# EAGLE schematic RC Receiver (EAGLE 6.5.0)
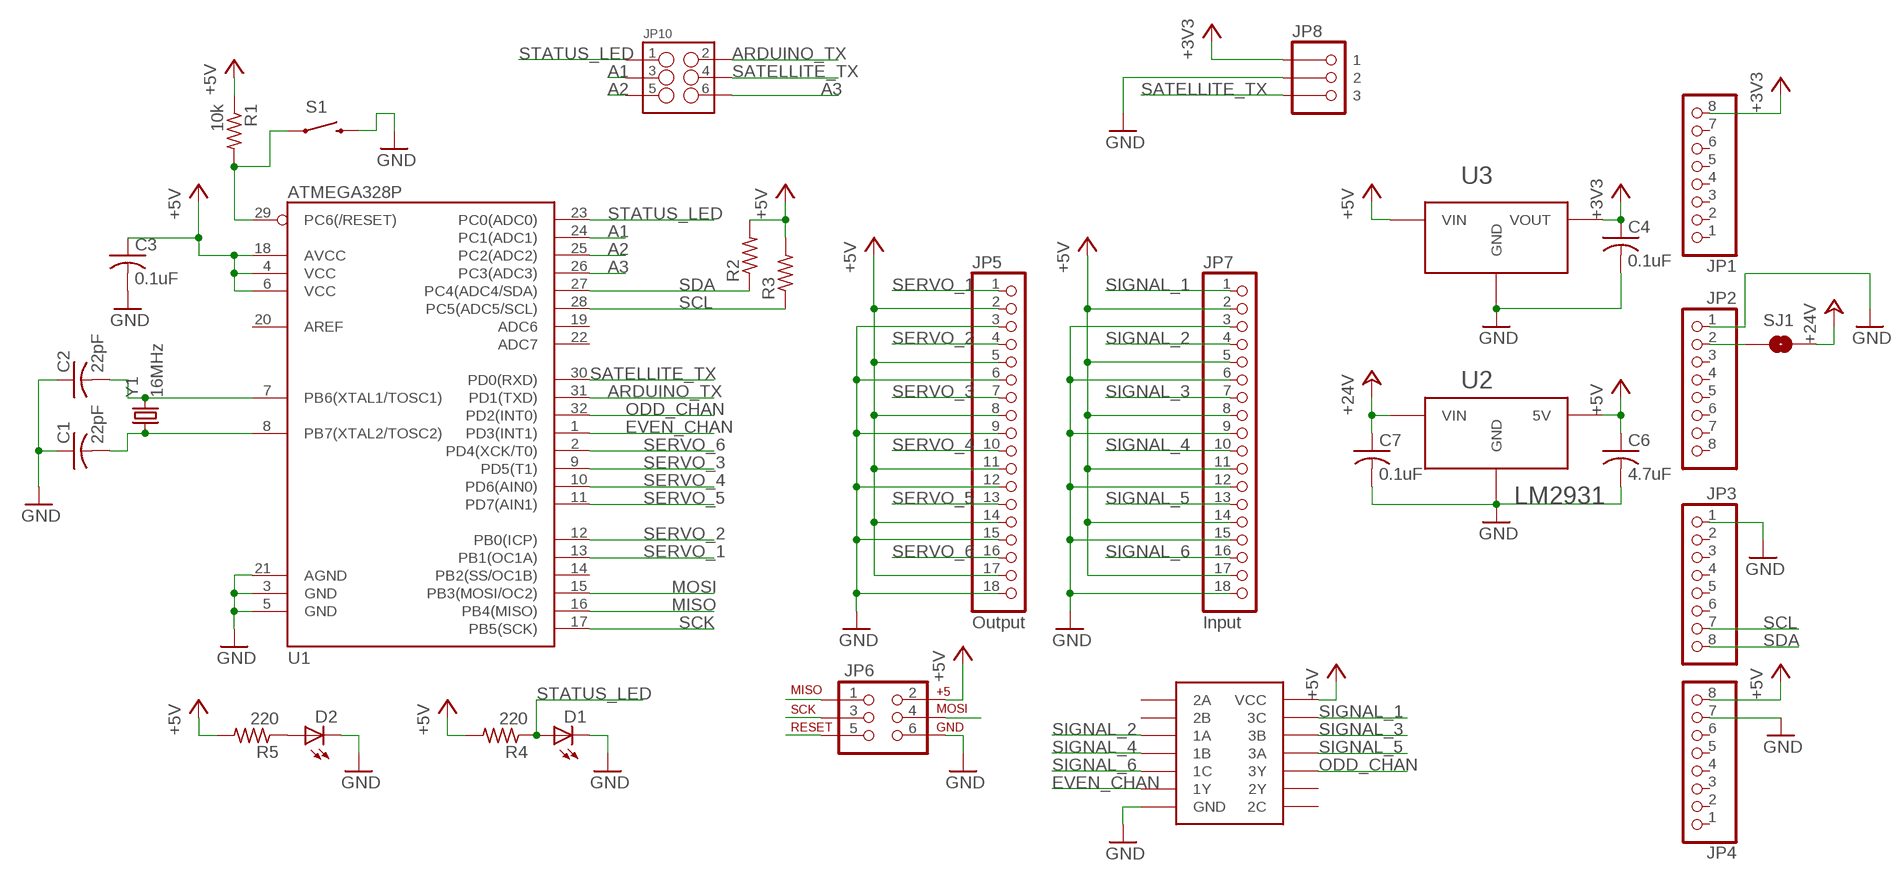
[diagram p0: schematic, sheet 1]

## Parts
C1  22pF  C-USC0603  [C0603]
C2  22pF  C-USC0603  [C0603]
C3  0.1uF  C-USC0603  [C0603]
C4  0.1uF  C-USC0603  [C0603]
C6  4.7uF  C-USC0603  [C0603]
C7  0.1uF  C-USC0603  [C0603]
D1  LED-GREENLED-0805_NO_SILK  [LED-0805]
D2  LED-GREENLED-0805_NO_SILK  [LED-0805]
JP1  PINHD-1X81X08_NO_SILK  [1X08_NO_SS]
JP2  PINHD-1X81X08_NO_SILK  [1X08_NO_SS]
JP3  PINHD-1X81X08_NO_SILK  [1X08_NO_SS]
JP4  PINHD-1X81X08_NO_SILK  [1X08_NO_SS]
JP5  Output  18_PIN_HEADER3X6_PTH_HEADER  [3X6_PTH_HEADER]
JP6  AVR_SPI_PRG_62X3_LOCK  [2X3_LOCK]
JP7  Input  18_PIN_HEADER3X6_PTH_HEADER  [3X6_PTH_HEADER]
JP8  3-PIN_JST_ZH_PTH_CONNECTORRIGHT_ANGLE_PTH  [3-PIN_JST_ZH_CONNECTOR_TH]
JP10  M03X2NO_SILK  [2X3-NS]
R1  10k  R-US_R0603  [R0603]
R2  R-US_R0603  [R0603]
R3  R-US_R0603  [R0603]
R4  220  R-US_R0603  [R0603]
R5  220  R-US_R0603  [R0603]
S1  SWITCH-MOMENTARY-2SMD  [TACTILE_SWITCH_SMD]
SJ1  SOLDERJUMPERNC  [SJ_2S]
U1  ATMEGA328P  ATMEGA328_SMT  [TQFP32-08]
U2  LM2931  [TO263]
U3  AP7313SOT23R  [SOT23]
U4  C74HC407514-SOIC  [14-SOIC]
Y1  16MHz  CRYSTAL5X3  [CRYSTAL-SMD-5X3]

## Nets
+3V3: C4.1 JP1.8 JP8.P$1 U3.P$2(VOUT)
+5V: C3.1 C6.1 JP4.8 JP5.2 JP5.5 JP5.8 JP5.11 JP5.14 JP5.17 JP6.2 JP7.2 JP7.5 JP7.8 JP7.11 JP7.14 JP7.17 R1.1 R2.2 R3.2 R4.2 R5.2 U1.4(VCC) U1.6(VCC) U1.18(AVCC) U2.P$3(5V) U3.P$3(VIN) U4.P$14(VCC)
+24V: C7.1 SJ1.2 U2.P$2(VIN)
A1: JP10.3 U1.24(PC1(ADC1))
A2: JP10.5 U1.25(PC2(ADC2))
A3: JP10.6 U1.26(PC3(ADC3))
ARDUINO_TX: JP10.2 U1.31(PD1(TXD))
EVEN_CHAN: U1.1(PD3(INT1)) U4.P$6(1Y)
GND: C1.1 C2.1 C3.2 C4.2 C6.2 C7.2 D1.2(C) D2.2(C) JP2.1 JP3.1 JP4.7 JP5.3 JP5.6 JP5.9 JP5.12 JP5.15 JP5.18 JP6.6 JP7.3 JP7.6 JP7.9 JP7.12 JP7.15 JP7.18 JP8.P$2 S1.3 U1.3(GND) U1.5(GND) U1.21(AGND) U2.P$1(GND) U3.P$1(GND) U4.P$7(GND)
MISO: JP6.1 U1.16(PB4(MISO))
MOSI: JP6.4 U1.15(PB3(MOSI/OC2))
N$1: C2.2 U1.7(PB6(XTAL1/TOSC1)) Y1.3
N$2: C1.2 U1.8(PB7(XTAL2/TOSC2)) Y1.1
N$4: D2.1(A) R5.1
N$5: JP2.2 SJ1.1
ODD_CHAN: U1.32(PD2(INT0)) U4.P$10(3Y)
RESET: JP6.5 R1.2 S1.1 U1.29(PC6(/RESET))
SATELLITE_TX: JP8.P$3 JP10.4 U1.30(PD0(RXD))
SCK: JP6.3 U1.17(PB5(SCK))
SCL: JP3.7 R3.1 U1.28(PC5(ADC5/SCL))
SDA: JP3.8 R2.1 U1.27(PC4(ADC4/SDA))
SERVO_1: JP5.1 U1.13(PB1(OC1A))
SERVO_2: JP5.4 U1.12(PB0(ICP))
SERVO_3: JP5.7 U1.9(PD5(T1))
SERVO_4: JP5.10 U1.10(PD6(AIN0))
SERVO_5: JP5.13 U1.11(PD7(AIN1))
SERVO_6: JP5.16 U1.2(PD4(XCK/T0))
SIGNAL_1: JP7.1 U4.P$13(3C)
SIGNAL_2: JP7.4 U4.P$3(1A)
SIGNAL_3: JP7.7 U4.P$12(3B)
SIGNAL_4: JP7.10 U4.P$4(1B)
SIGNAL_5: JP7.13 U4.P$11(3A)
SIGNAL_6: JP7.16 U4.P$5(1C)
STATUS_LED: D1.1(A) JP10.1 R4.1 U1.23(PC0(ADC0))
Unconnected: JP1.1 JP1.2 JP1.3 JP1.4 JP1.5 JP1.6 JP1.7 JP2.3 JP2.4 JP2.5 JP2.6 JP2.7 JP2.8 JP3.2 JP3.3 JP3.4 JP3.5 JP3.6 JP4.1 JP4.2 JP4.3 JP4.4 JP4.5 JP4.6 U1.14(PB2(SS/OC1B)) U1.19(ADC6) U1.20(AREF) U1.22(ADC7) U4.P$1(2A) U4.P$2(2B) U4.P$8(2C) U4.P$9(2Y)

## Library data of the parts
C1-C4 C6 C7 = resistor:C-US: CAPACITOR, American symbol
D1 D2 = SparkFun-LED:LED-GREEN: Various green LEDs 0603- DIO-00821 LARGE- DIO-00862 LILYPAD- DIO-09910
JP1-JP4 = pinhead:PINHD-1X8: PIN HEADER
JP5 JP7 = My Parts:18_PIN_HEADER
JP6 = SparkFun-Connectors:AVR_SPI_PRG_6: AVR ISP 6 Pin This is the reduced ISP connector for AVR programming. Common on Arduino. This footprint will take up less PCB space and can be used with a 10-pin to 6-pin adapter such as SKU: BOB-08508
JP8 = My Parts:3-PIN_JST_ZH_PTH_CONNECTOR; PART#: 455-1670-ND
JP10 = SparkFun-Connectors:M03X2: 2x3 .1" header. Shrouded, with keying- CONN-10681 SMT- CONN-11415 Pogo pins- HW-11044
R1-R5 = resistor:R-US_: RESISTOR, American symbol
S1 = SparkFun-Electromechanical:SWITCH-MOMENTARY-2: Various NO switches- pushbuttons, reed, etc
SJ1 = SparkFun-Passives:SOLDERJUMPER: Solder Jumper Standard SMD solder jumper. Used to automate production. Two varients : Normally Open and Normally Closed are the same, but have different paste layers. NC will have a large amount of paste and should jumper during reflow.
U1 = SparkFun-DigitalIC:ATMEGA328_SMT: 32-Pin Atmega328 part Commonly used on Arduino compatible boards Available in QFP and QFN packages TQFP is IC-09069 QFN is non-stock; PROD_ID: IC-09069
U2 = on-semiconductor:LM2931; PART#: lm2931
U3 = My Parts:AP7313: 3.3v LDO Voltage Regulator; PART#: AP7313-33SRG-7
U4 = My Parts:C74HC4075; PART#: 296-14534-1-ND
Y1 = SparkFun-FreqCtrl:CRYSTAL: Various standard crystals. Proven footprints. Spark Fun Electronics SKU : COM-00534; PART#: 887-1104-1-ND